# EAGLE design RC_Engine_Sound_ESP32 (EAGLE 9.6.1)
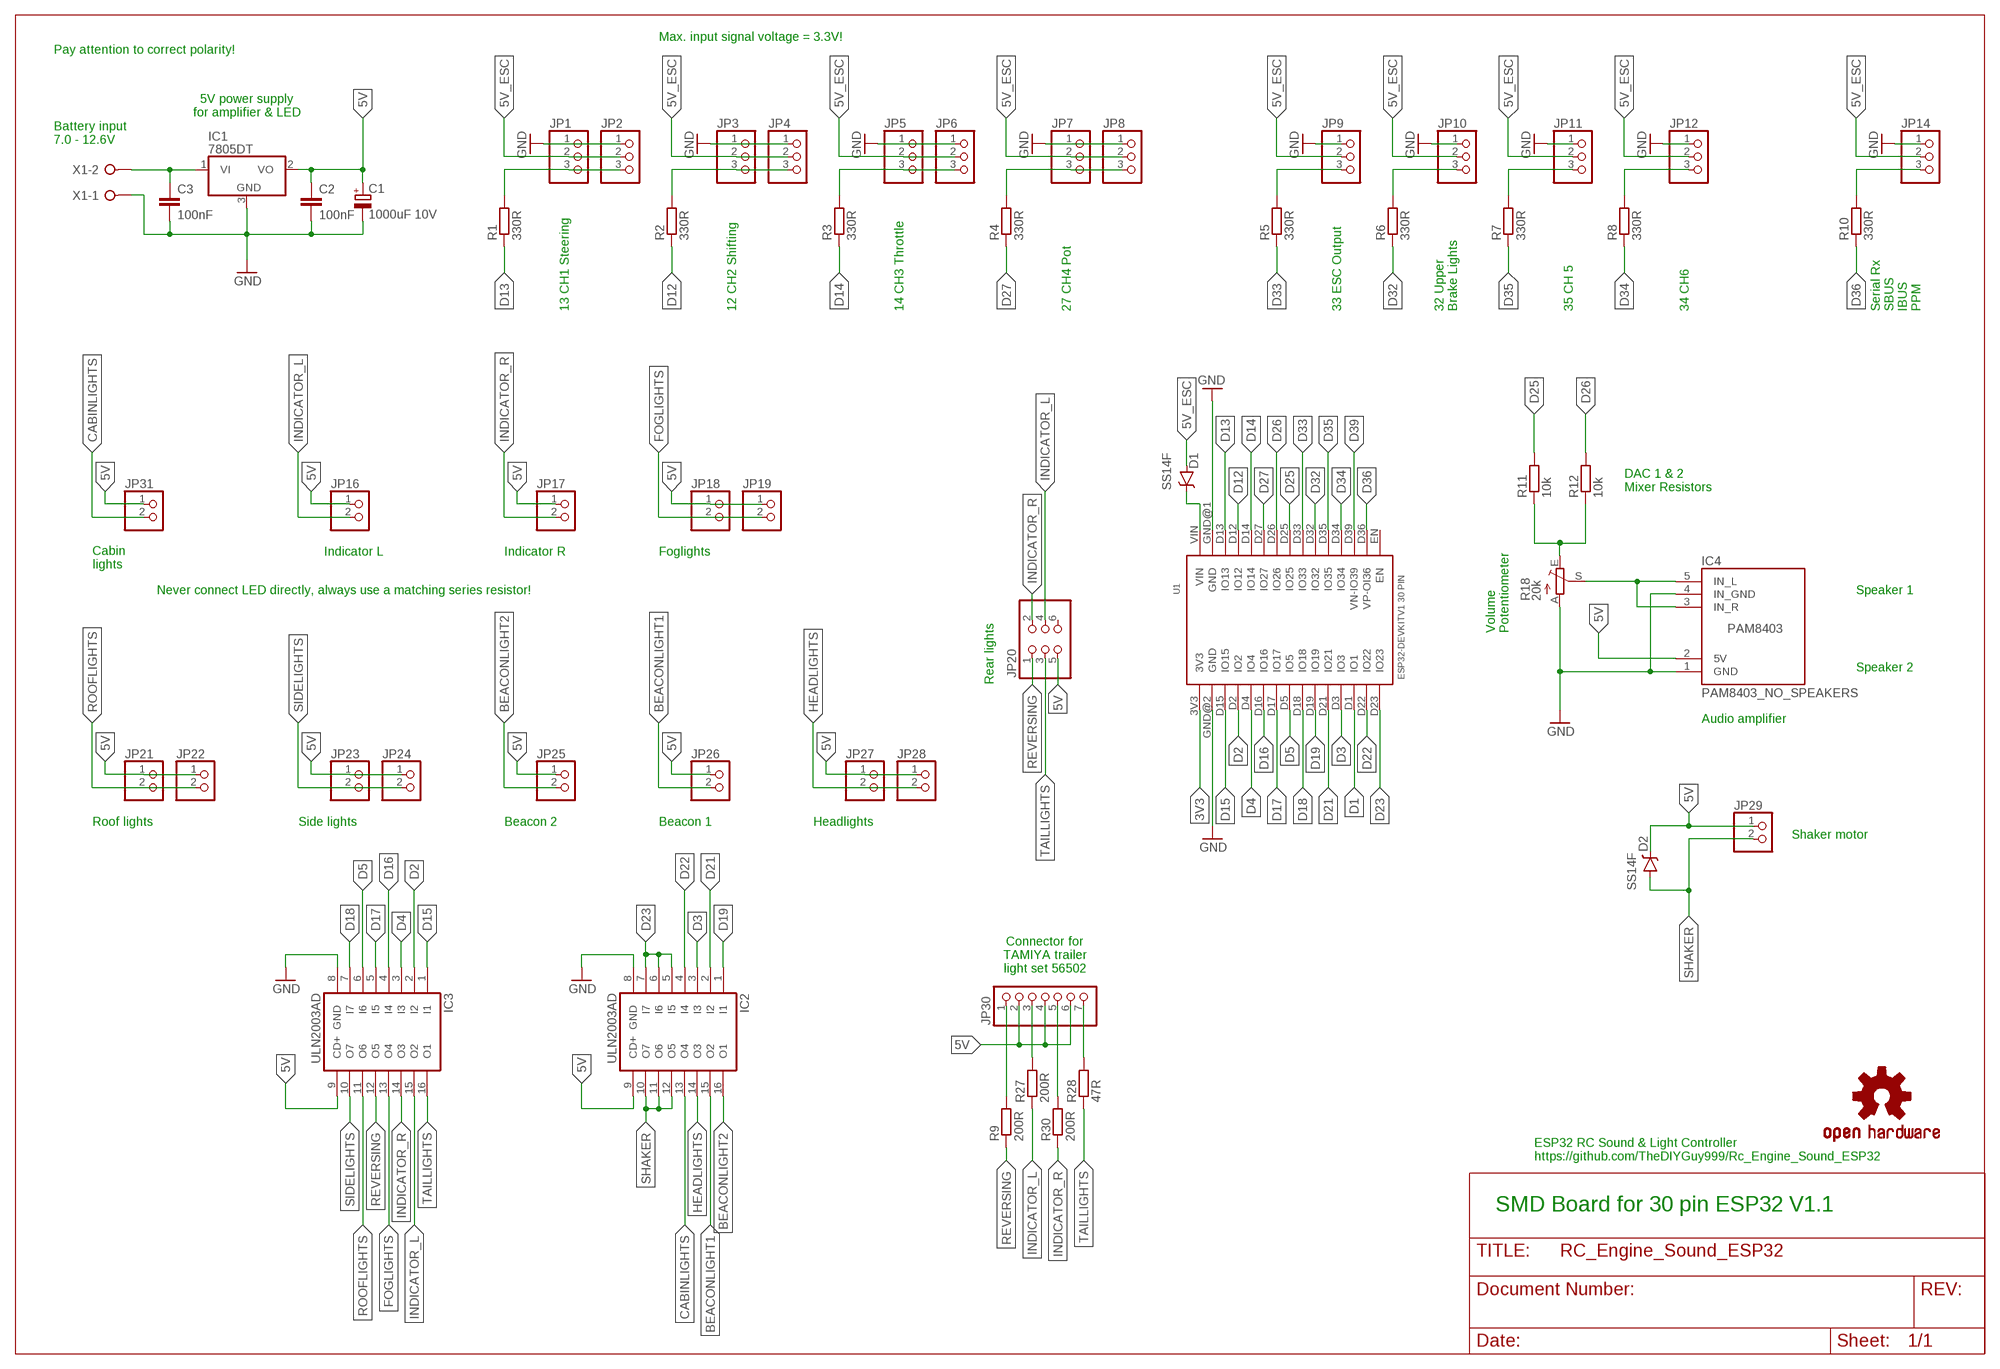
[diagram p0: schematic, sheet 1]

## Parts
C1  1000uF 10V  CPOL-EUUD-10X10  [UD-10X10_NICHICON]
C2  100nF  C-EUC0805  [C0805]
C3  100nF  C-EUC0805  [C0805]
D1  SS14F  MBRA140  [SMA-DIODE]
D2  SS14F  MBRA140  [SMA-DIODE]
IC1  7805DT  [TO252]
IC2  ULN2003AD  [SO16]
IC3  ULN2003AD  [SO16]
IC4  PAM8403_NO_SPEAKERS  [PAM8403_NO_SPEAKERS]
JP1  PINHD-1X3  [1X03]
JP2  PINHD-1X3  [1X03]
JP3  PINHD-1X3  [1X03]
JP4  PINHD-1X3  [1X03]
JP5  PINHD-1X3  [1X03]
JP6  PINHD-1X3  [1X03]
JP7  PINHD-1X3  [1X03]
JP8  PINHD-1X3  [1X03]
JP9  PINHD-1X3  [1X03]
JP10  PINHD-1X3  [1X03]
JP11  PINHD-1X3  [1X03]
JP12  PINHD-1X3  [1X03]
JP14  PINHD-1X3  [1X03]
JP16  PINHD-1X2  [1X02]
JP17  PINHD-1X2  [1X02]
JP18  PINHD-1X2  [1X02]
JP19  PINHD-1X2  [1X02]
JP20  PINHD-2X3  [2X03]
JP21  PINHD-1X2  [1X02]
JP22  PINHD-1X2  [1X02]
JP23  PINHD-1X2  [1X02]
JP24  PINHD-1X2  [1X02]
JP25  PINHD-1X2  [1X02]
JP26  PINHD-1X2  [1X02]
JP27  PINHD-1X2  [1X02]
JP28  PINHD-1X2  [1X02]
JP29  PINHD-1X2  [1X02]
JP30  PINHD-1X7  [1X07]
JP31  PINHD-1X2  [1X02]
LOGO1  OSHW-LOGOM  [OSHW-LOGO-M]
R1  330R  R-EU_R0805  [R0805]
R2  330R  R-EU_R0805  [R0805]
R3  330R  R-EU_R0805  [R0805]
R4  330R  R-EU_R0805  [R0805]
R5  330R  R-EU_R0805  [R0805]
R6  330R  R-EU_R0805  [R0805]
R7  330R  R-EU_R0805  [R0805]
R8  330R  R-EU_R0805  [R0805]
R9  200R  R-EU_R0805  [R0805]
R10  330R  R-EU_R0805  [R0805]
R11  10k  R-EU_R0805  [R0805]
R12  10k  R-EU_R0805  [R0805]
R18  20k  TRIM_EU-S64W  [S64W]
R27  200R  R-EU_R0805  [R0805]
R28  47R  R-EU_R0805  [R0805]
R30  200R  R-EU_R0805  [R0805]
U1  ESP32DEVKITV1  [ESP32-DEVKITV1]
X1  W237-02P  [W237-132]

## Nets
3V3: U1.3V3
5V: C1.+ C2.1 D2.C IC1.2(VO) IC2.9(CD+) IC3.9(CD+) IC4.2(5V) JP16.1 JP17.1 JP18.1 JP19.1 JP20.5 JP21.1 JP22.1 JP23.1 JP24.1 JP25.1 JP26.1 JP27.1 JP28.1 JP29.1 JP30.2 JP30.4 JP30.6 JP31.1
5V_ESC: D1.A JP1.2 JP2.2 JP3.2 JP4.2 JP5.2 JP6.2 JP7.2 JP8.2 JP9.2 JP10.2 JP11.2 JP12.2 JP14.2
BAT+: C3.1 IC1.1(VI) X1.2
BEACONLIGHT1: IC2.15(O2) JP26.2
BEACONLIGHT2: IC2.16(O1) JP25.2
CABINLIGHTS: IC2.13(O4) JP31.2
D1: U1.D1(IO1)
D2: IC3.2(I2) U1.D2(IO2)
D3: IC2.3(I3) U1.D3(IO3)
D4: IC3.3(I3) U1.D4(IO4)
D5: IC3.6(I6) U1.D5(IO5)
D12: R2.1 U1.D12(IO12)
D13: R1.1 U1.D13(IO13)
D14: R3.1 U1.D14(IO14)
D15: IC3.1(I1) U1.D15(IO15)
D16: IC3.4(I4) U1.D16(IO16)
D17: IC3.5(I5) U1.D17(IO17)
D18: IC3.7(I7) U1.D18(IO18)
D19: IC2.1(I1) U1.D19(IO19)
D21: IC2.2(I2) U1.D21(IO21)
D22: IC2.4(I4) U1.D22(IO22)
D23: IC2.5(I5) IC2.6(I6) IC2.7(I7) U1.D23(IO23)
D25: R11.2 U1.D25(IO25)
D26: R12.2 U1.D26(IO26)
D27: R4.1 U1.D27(IO27)
D32: R6.1 U1.D32(IO32)
D33: R5.1 U1.D33(IO33)
D34: R8.1 U1.D34(IO34)
D35: R7.1 U1.D35(IO35)
D36: R10.1 U1.D36(VP-OI36)
D39: U1.D39(VN-IO39)
FOGLIGHTS: IC3.13(O4) JP18.2 JP19.2
GND: C1.- C2.2 C3.2 IC1.3(GND) IC2.8(GND) IC3.8(GND) IC4.1(GND) IC4.4(IN_GND) JP1.1 JP2.1 JP3.1 JP4.1 JP5.1 JP6.1 JP7.1 JP8.1 JP9.1 JP10.1 JP11.1 JP12.1 JP14.1 R18.A U1.GND@1(GND) U1.GND@2(GND) X1.1
HEADLIGHTS: IC2.14(O3) JP27.2 JP28.2
INDICATOR_L: IC3.15(O2) JP16.2 JP20.4 R27.1
INDICATOR_R: IC3.14(O3) JP17.2 JP20.2 R30.1
N$1: IC4.3(IN_R) IC4.5(IN_L) R18.S
N$2: R11.1 R12.1 R18.E
N$3: JP1.3 JP2.3 R1.2
N$4: JP30.7 R28.2
N$5: JP3.3 JP4.3 R2.2
N$6: JP5.3 JP6.3 R3.2
N$7: JP7.3 JP8.3 R4.2
N$8: JP9.3 R5.2
N$9: D1.C U1.VIN
N$10: JP10.3 R6.2
N$11: JP11.3 R7.2
N$12: JP12.3 R8.2
N$13: JP30.5 R30.2
N$14: JP14.3 R10.2
N$15: JP30.3 R27.2
N$16: JP30.1 R9.2
REVERSING: IC3.12(O5) JP20.1 R9.1
ROOFLIGHTS: IC3.11(O6) JP21.2 JP22.2
SHAKER: D2.A IC2.10(O7) IC2.11(O6) IC2.12(O5) JP29.2
SIDELIGHTS: IC3.10(O7) JP23.2 JP24.2
TAILLIGHTS: IC3.16(O1) JP20.3 R28.1
Unconnected: JP20.6 U1.EN

## Notes on the sheet
- Max. input signal voltage = 3.3V!
- Pay attention to correct polarity!
- 5V power supply
  for amplifier & LED
- Battery input
  7.0 - 12.6V
- 13 CH1 Steering | 12 CH2 Shifting | 14 CH3 Throttle | 27 CH4 Pot | 33 ESC Output
- 32 Upper
  Brake Lights
- 35 CH 5 | 34 CH6
- Serial Rx
  SBUS
  IBUS
  PPM
- DAC 1 & 2
  Mixer Resistors
- Indicator L | Indicator R | Foglights
- Cabin
  lights
- Never connect LED directly, always use a matching series resistor! | Speaker 1
- Volume
  Potentiometer
- Speaker 2
- Rear lights
- Audio amplifier
- Roof lights | Side lights | Beacon 2 | Beacon 1 | Headlights
- Shaker motor
- Connector for
  TAMIYA trailer
  light set 56502
- ESP32 RC Sound & Light Controller
  https://github.com/TheDIYGuy999/Rc_Engine_Sound_ESP32
- SMD Board for 30 pin ESP32 V1.1

## Library data of the parts
C1 = rcl:CPOL-EU: POLARIZED CAPACITOR, European symbol; SPICEPREFIX: C
C2 C3 = rcl:C-EU: CAPACITOR, European symbol
D1 D2 = SparkFun-DiscreteSemi:MBRA140: 40V, 1A Schottky rectifier SMA/DO-214AC package DIO-08053; PROD_ID: DIO-08053
IC1 = linear:78*: Positive VOLTAGE REGULATOR Source: http://cache.national.com/ds/LM/LM78L05.pdf http://www.fairchildsemi.com/ds/LM/LM7805.pdf
IC2 IC3 = uln-udn:ULN2003A: DRIVER ARRAY
IC4 = 00_custom:PAM8403_NO_SPEAKERS
JP1-JP12 JP14 = 00_custom_pinhead:PINHD-1X3: PIN HEADER
JP16-JP19 JP21-JP29 JP31 = 00_custom_pinhead:PINHD-1X2: PIN HEADER
JP20 = 00_custom_pinhead:PINHD-2X3: PIN HEADER
JP30 = 00_custom_pinhead:PINHD-1X7: PIN HEADER
LOGO1 = SparkFun-Aesthetics:OSHW-LOGO: Open Source Hardware Logo This logo indicates the piece of hardware it is found on incorporates a OSHW license and/or adheres to the definition of open source hardware found here: http://freedomdefined.org/OSHW
R1-R12 R27 R28 R30 = rcl:R-EU_: RESISTOR, European symbol; SPICEPREFIX: R
R18 = pot:TRIM_EU-: POTENTIOMETER
U1 = ESP32-DEVKITV1_30pin:ESP32DEVKITV1
X1 = con-wago-508:W237-02P: WAGO SREW CLAMP; OC_FARNELL: unknown; OC_NEWARK: unknown

## Net classes
0 5V: clearance 0.254 mm

## Board
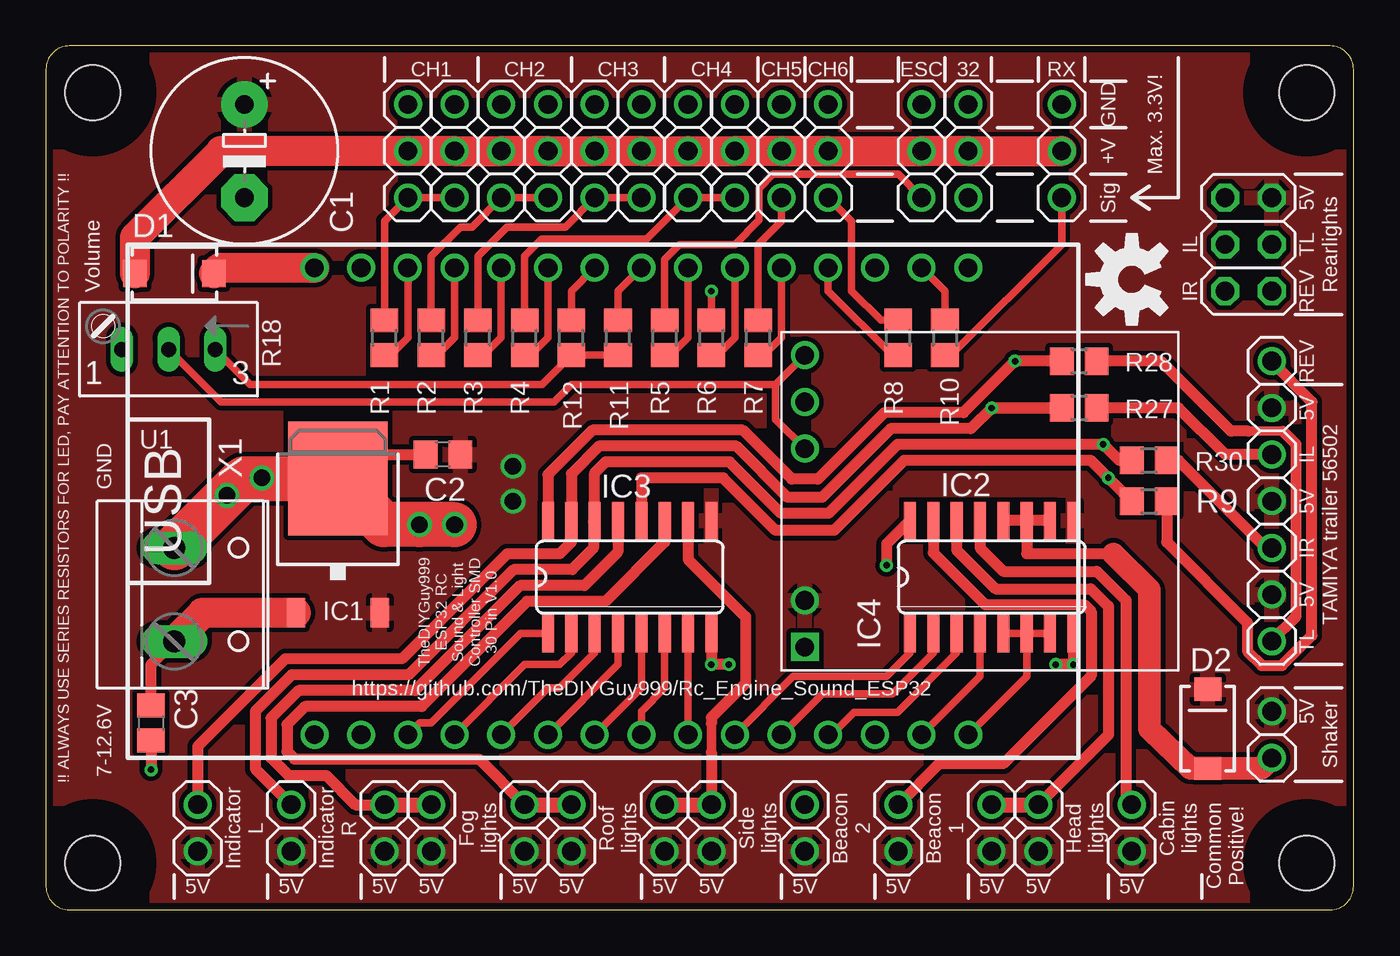
[diagram p1: board, top side]
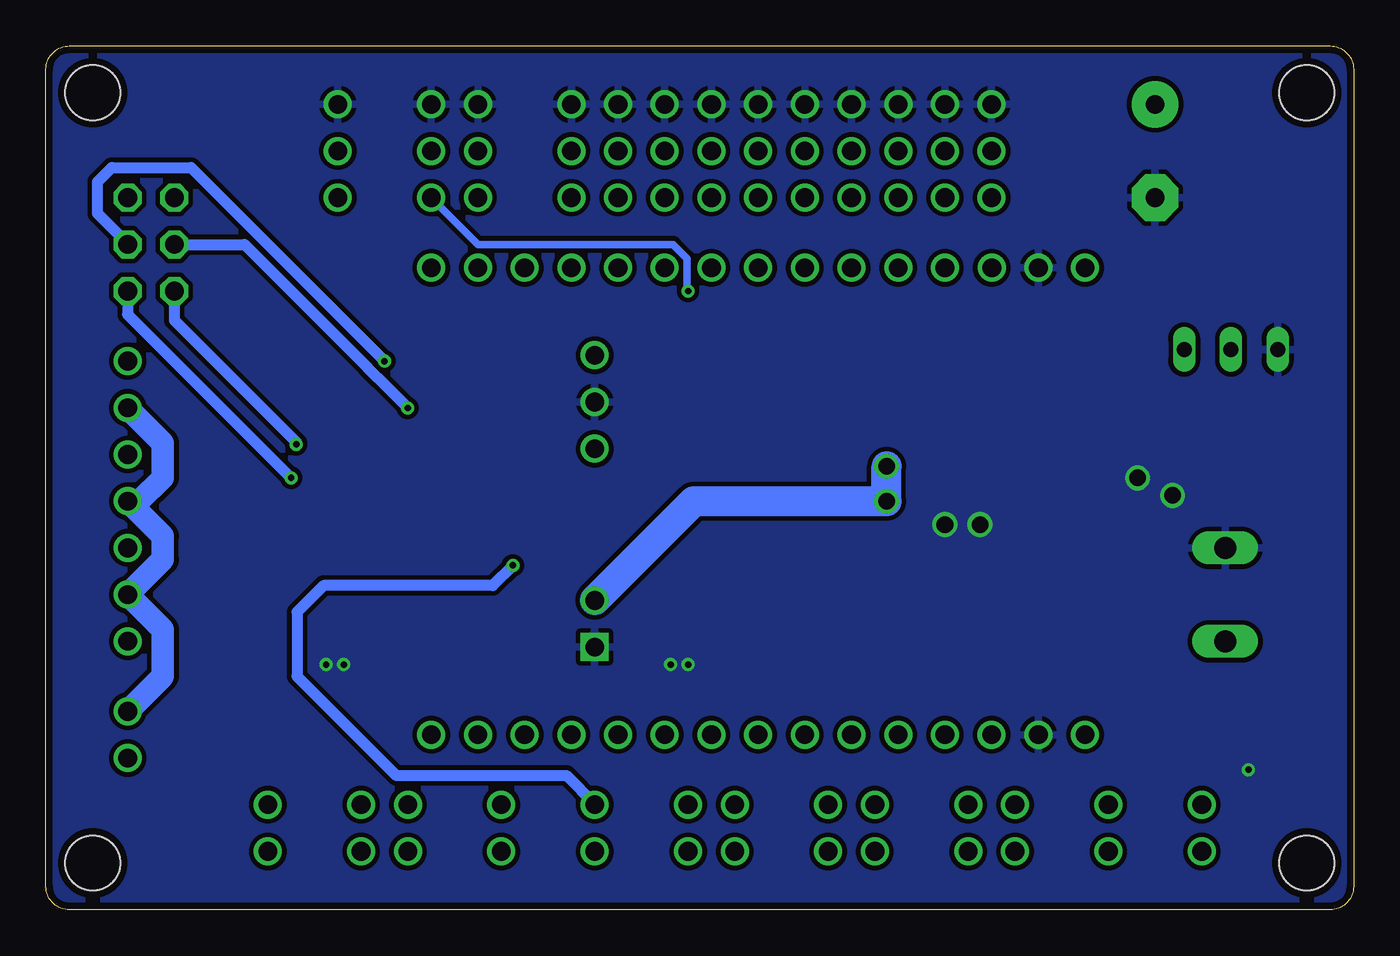
[diagram p2: board, bottom side, seen from below]

Size 71.12 x 46.99 mm. Coordinates in mm from the lower left corner, seen from the top.
Outline: 0,45.72 0,1.27 arc90 1.27,0 69.85,0 arc90 71.12,1.27 71.12,45.72 arc90 69.85,46.99 1.27,46.99 arc90 0,45.72
Copper layers (1*16): Top 0.0356mm / dielectric 1.5011mm / Bottom 0.0356mm
Design rules "OSHPark_LaenPCBOrder": minimum track width 6mil, minimum drill 13mil, track to track 6mil, track to pad 6mil, pad to pad 6mil, via to via 6mil, smd to smd 6mil, copper to edge 15mil, drill to drill 6mil, minimum pad ring 7mil, minimum via ring 7mil, stop-mask expansion 3mil, vias tented up to drill 0mil, thermal gap 10mil
Holes 3 mm at 2.54,44.45 2.54,2.54 68.58,2.54 68.58,44.45
tRestrict: area -0.7,41.2 to 5.8,47.7; area 65.3,41.2 to 71.8,47.7; area 65.3,-0.7 to 71.8,5.8; area -0.7,-0.7 to 5.8,5.8

### Footprints (pad centres in the part's own frame; a part is rotated, then mirrored left to right if it is on the bottom)
E5-10,5 = drill 1.016 pad 2.54: + -2.54,0 | drill 1.016 pad 2.54 octagon: - 2.54,0
C0805 = smd 1.3 x 1.5: 1 -0.95,0; 2 0.95,0
SMA-DIODE = smd 1.27 x 1.47: A -2.15,0; C 2.15,0
TO252 = smd 1 x 1.6: 1 -2.28,-4.8; 2 2.28,-4.8 | smd 5.4 x 6.2: 3 0,2.5
SO16 = smd 0.66 x 2.032: 1 -4.445,-3.073; 2 -3.175,-3.073; 3 -1.905,-3.073; 4 -0.635,-3.073; 5 0.635,-3.073; 6 1.905,-3.073; 7 3.175,-3.073; 8 4.445,-3.073; 9 4.445,3.073; 10 3.175,3.073; 11 1.905,3.073; 12 0.635,3.073; 13 -0.635,3.073; 14 -1.905,3.073; 15 -3.175,3.073; 16 -4.445,3.073
PAM8403_NO_SPEAKERS = drill 1.016 square: 1 -7.62,8.89 | drill 1.016: 2 -5.08,8.89; 3 3.175,8.89; 4 5.715,8.89; 5 8.255,8.89
1X03 = drill 1.016 pad 1.524: 1 -2.54,0; 2 0,0; 3 2.54,0
1X02 = drill 1.016 pad 1.524: 1 -1.27,0; 2 1.27,0
2X03 = drill 1.016 octagon: 1 -2.54,-1.27; 2 -2.54,1.27; 3 0,-1.27; 4 0,1.27; 5 2.54,-1.27; 6 2.54,1.27
1X07 = drill 1.016: 1 -7.62,0; 2 -5.08,0; 3 -2.54,0; 4 0,0; 5 2.54,0; 6 5.08,0; 7 7.62,0
R0805 = smd 1.3 x 1.5: 1 -0.95,0; 2 0.95,0
S64W = drill 0.813 long: A 2.54,1.27; E -2.54,1.27; S 0,1.27
ESP32-DEVKITV1 = drill 1.016: 3V3 -16.51,-12.7; D1 13.97,-12.7; D2 -8.89,-12.7; D3 11.43,-12.7; D4 -6.35,-12.7; D5 1.27,-12.7; D12 -8.89,12.7; D13 -11.44,12.7; D14 -6.35,12.7; D15 -11.43,-12.7; D16 -3.81,-12.7; D17 -1.27,-12.7; D18 3.81,-12.7; D19 6.35,-12.7; D21 8.89,-12.7; D22 16.51,-12.7; D23 19.05,-12.7; D25 1.27,12.7; D26 -1.27,12.7; D27 -3.81,12.7; D32 6.35,12.7; D33 3.81,12.7; D34 11.43,12.7; D35 8.89,12.7; D36 16.51,12.7; D39 13.97,12.7; EN 19.05,12.7; GND@1 -13.97,12.7; GND@2 -13.97,-12.7; VIN -16.51,12.7
W237-132 = drill 1.194 long: 1 -2.54,-0.635; 2 2.54,-0.635

### Placement (x,y rotation side)
C1  1000uF  [E5-10,5]  10.79,41.27 270 top
C2  21.59,24.77 180 top
C3  5.71,10.16 270 top
D1  6.99,34.61 0 top
D2  63.18,9.84 90 top
IC1  15.88,20.96 0 top
IC2  51.44,18.1 0 top
IC3  31.75,18.1 0 top
IC4  50.16,21.91 90 top
JP1  19.68,41.27 270 top
JP2  22.22,41.27 270 top
JP3  24.76,41.27 270 top
JP4  27.3,41.27 270 top
JP5  29.84,41.27 270 top
JP6  32.39,41.27 270 top
JP7  34.93,41.27 270 top
JP8  37.47,41.27 270 top
JP9  47.62,41.27 270 top
JP10  50.16,41.27 270 top
JP11  40.01,41.27 270 top
JP12  42.55,41.27 270 top
JP14  55.25,41.27 270 top
JP16  8.26,4.45 90 top
JP17  13.34,4.45 90 top
JP18  18.41,4.45 90 top
JP19  20.95,4.45 90 top
JP20  65.41,36.2 90 top
JP21  26.04,4.45 90 top
JP22  28.57,4.45 90 top
JP23  33.66,4.45 90 top
JP24  36.2,4.45 90 top
JP25  41.27,4.45 90 top
JP26  46.36,4.45 90 top
JP27  51.44,4.45 90 top
JP28  53.98,4.45 90 top
JP29  66.67,9.53 270 top
JP30  66.67,22.23 270 top
JP31  59.05,4.45 90 top
LOGO1  59.05,34.29 90 top
R1  18.41,31.12 90 top
R2  20.95,31.12 90 top
R3  23.49,31.12 90 top
R4  26.04,31.12 90 top
R5  33.66,31.12 90 top
R6  36.2,31.12 90 top
R7  38.73,31.12 90 top
R8  46.36,31.12 90 top
R9  60.01,22.23 0 top
R10  48.9,31.12 270 top
R11  31.11,31.12 90 top
R12  28.57,31.12 90 top
R18  6.67,31.75 180 top
R27  56.2,27.31 0 top
R28  56.2,29.85 0 top
R30  60.01,24.45 0 top
U1  31.11,22.23 0 top
X1  7.62,17.15 270 top

### Tracks (layer width: path | path; a pad name or v marks a point on that pad's centre or on a via)
5V  (via drill 0.9)
  Bottom 1.219: JP30.2 64.77,25.4 64.77,23.5 66.04,22.23 JP30.4 64.77,20.32 64.77,19.05 JP30.6 64.77,15.24 64.77,12.7 JP29.1
  Bottom 1.626: IC4.2 35.88,22.23 v25.4,22.23 v25.4,24.13
  pour Top: -3.13,-1.91 -3.13,19.52 -2.8,48.89 73.02,48.89 73.02,-1.91
5V_ESC
  Top 1.626: JP12.2 JP11.2 | JP11.2 JP9.2 JP10.2 JP14.2 | JP11.2 JP8.2 JP7.2 JP6.2 JP5.2 JP4.2 JP3.2 JP2.2 JP1.2 9.53,41.27 4.83,36.59 D1.A
BAT+
  Top 0.61: C3.1 5.71,13.33 X1.2
  Top 1.626: X1.2 6.99,14.62 8.52,16.16 IC1.1
BEACONLIGHT1
  Top 0.61: IC2.15 48.26,19.42 51.08,16.6 56.48,16.6 56.86,16.22 56.86,12.72 52.07,7.94 48.58,7.94 JP26.2
BEACONLIGHT2  (via drill 0.35)
  Top 0.61: IC2.16 45.72,19.9 v45.72,18.73
  Bottom 0.61: v45.72,18.73 46.82,17.64 56.02,17.64 57.47,16.19 57.47,12.7 52.07,7.3 42.81,7.3 41.27,5.77 JP25.2
CABINLIGHTS
  Top 0.61: IC2.13 50.8,19.69 52.07,18.42 57.15,18.42 58.74,16.83 58.74,6.03 JP31.2
D2
  Top 0.406: U1.D2 26.04,13.33 27.94,13.33 28.57,13.97 IC3.2
D3
  Top 0.406: IC2.3 49.53,13.97 46.3,10.74 43.95,10.74 42.73,9.53 U1.D3
D4
  Top 0.406: U1.D4 27.3,12.06 27.94,12.06 29.84,13.97 IC3.3
D5
  Top 0.406: U1.D5 32.39,10.79 33.66,12.06 33.66,15.88
  Top 0.61: IC3.6 33.66,15.88
D12
  Top 0.406: U1.D12 22.22,31.12 21.27,30.17 R2.1
D13
  Top 0.406: U1.D13 19.68,31.12 18.73,30.17 R1.1
D14
  Top 0.406: U1.D14 24.76,31.12 23.81,30.17 R3.1
D15
  Top 0.406: U1.D15 20.32,10.16 20.95,10.16 25.82,15.02 IC3.1
D16
  Top 0.406: U1.D16 31.11,13.33 IC3.4
D17
  Top 0.406: U1.D17 32.39,12.06 IC3.5
D18
  Top 0.406: U1.D18 IC3.7
D19
  Top 0.406: U1.D19 40.64,12.7 45.72,12.7 46.99,13.97 IC2.1
D21
  Top 0.406: IC2.2 48.26,13.97 46.04,11.75 42.23,11.75 U1.D21
D22
  Top 0.406: IC2.4 50.8,12.7 U1.D22
D23
  Top 0.406: IC2.7 IC2.6 | IC2.6 IC2.5 | IC2.6 53.34,12.7 U1.D23
D25
  Top 0.406: R11.2 31.11,33.66 U1.D25
D26
  Top 0.406: R12.2 28.57,33.66 U1.D26
D27
  Top 0.406: U1.D27 27.3,31.12 26.35,30.17 R4.1
D32
  Top 0.406: U1.D32 37.47,31.12 36.52,30.17 R6.1
D33
  Top 0.406: U1.D33 34.93,31.12 33.98,30.17 R5.1
D34
  Top 0.406: U1.D34 42.55,33.66 46.04,30.17 R8.1
D35
  Top 0.406: U1.D35 40.01,31.12 39.05,30.17 R7.1
D36
  Top 0.406: U1.D36 48.9,33.66 R10.1
FOGLIGHTS
  Top 0.61: JP18.2 16.83,5.71 15.24,7.3 13.2,7.3 12.24,8.26 12.24,10.44 13.73,11.92 20.08,11.92 25.8,17.64 29.29,17.64 31.11,19.46 IC3.13
  Top 0.813: JP18.2 JP19.2
GND  (via drill 0.35, 0.9)
  Top 0.61: IC3.8 v36.2,13.33 v37.15,13.33 | IC2.8 v55.88,13.33 v54.93,13.33 | IC1.3 17.18,24.77 C2.2 | C3.2 v5.71,7.62
  Top 2.438: X1.1 10.76,23.46 IC1.3 18.38,20.96 v20.32,20.96 v22.22,20.96
  other vias: 11.75,23.5 9.84,22.54
  pour Bottom: -0.64,47.62 71.75,47.62 71.75,-0.64 -0.64,-0.64
HEADLIGHTS
  Top 0.61: IC2.14 49.53,19.58 51.65,17.46 56.83,17.46 57.79,16.51 57.79,9.53 JP28.2
  Top 0.813: JP27.2 JP28.2
INDICATOR_L  (via drill 0.35)
  Top 0.61: JP16.2 8.26,8.89 13.02,13.65 19.37,13.65 25.08,19.37 27.94,19.37 28.57,20 IC3.15 28.57,23.71 30.08,25.22 37.55,25.22 40.34,22.43 42.21,22.43 45.96,26.18 50.31,26.18 v51.44,27.31 R27.1 51.46,27.31 v51.45,27.29
  Bottom 0.61: JP20.4 60.33,36.2 53.62,29.49 53.62,29.47 53.09,28.93 53.06,28.93 v51.44,27.31 v51.45,27.29
INDICATOR_R  (via drill 0.35)
  Top 0.61: R30.1 58.37,24.45 v57.51,25.31 46.32,25.31 42.57,21.57 39.98,21.57 37.19,24.36 30.44,24.36 29.84,23.76 IC3.14 29.78,21.11 29.78,19.67 28.61,18.5 25.44,18.5 19.72,12.79 13.38,12.79 11.38,10.79 11.38,7.67 JP17.2
  Bottom 0.61: JP20.2 64.13,32.07 57.47,25.4 57.47,25.35 v57.51,25.31
N$1
  Top 0.406: IC4.3 39.69,26.67 39.69,28.58 | R18.S 9.53,27.62 27.62,27.62 28.57,28.58 39.69,28.58 | IC4.5 39.69,28.58
N$2
  Top 0.406: R11.1 R12.1 26.98,28.58 11.11,28.58 R18.E
N$3
  Top 0.406: R1.2 18.41,37.46 JP1.3 JP2.3
N$4
  Top 0.508: 67.27,26.04 65.41,26.04
  Top 0.61: JP30.7 66.67,14.64 68,15.96 68,25.31 67.27,26.04 | 65.41,26.04 64.45,26.04 60.64,29.85 R28.2
N$5
  Top 0.406: R2.2 20.95,35.56 22.54,37.15 23.18,37.15 JP3.3 JP4.3
N$6
  Top 0.406: JP6.3 JP5.3 28.26,37.15 25.08,37.15 23.49,35.56 R3.2
N$7
  Top 0.406: JP8.3 JP7.3 32.68,36.49 26.96,36.49 26.04,35.56 R4.2
N$8
  Top 0.406: JP9.3 46.36,40 39.55,40 38.79,39.24 38.79,37.52 37.47,36.2 34.47,36.2 33.66,35.38 R5.2
N$9
  Top 1.626: D1.C 9.45,34.92 U1.VIN
N$10  (via drill 0.35)
  Top 0.406: R6.2 v36.2,33.66
  Bottom 0.406: v36.2,33.66 36.25,33.71 36.25,35.43 37.01,36.2 47.62,36.2 JP10.3
N$11
  Top 0.406: R7.2 38.73,36.2 40.01,37.46 JP11.3
N$12
  Top 0.406: JP12.3 43.82,37.46 43.82,33.66 45.41,32.06 R8.2
N$13
  Top 0.61: JP30.5 66.36,19.69 61.59,24.45 R30.2
N$14
  Top 0.406: R10.2 49.22,30.17 55.25,36.2 JP14.3
N$15
  Top 0.61: JP30.3 64.13,24.77 61.59,27.31 R27.2
N$16
  Top 0.61: JP30.1 66.67,29.81 68.86,27.62 68.86,14.92 67.22,13.28 66.13,13.28 65.35,14.06 65.35,15.61 60.96,20 R9.2
REVERSING  (via drill 0.35)
  Top 0.61: R9.1 58.74,22.54 v57.79,23.5 56.83,24.45 46.67,24.45 42.86,20.64 39.69,20.64 36.83,23.5 32.39,23.5 IC3.12
  Bottom 0.61: JP20.1 66.67,32.38 v57.79,23.5
ROOFLIGHTS
  Top 0.61: IC3.11 33.66,20 30.43,16.78 26.16,16.78 20.44,11.06 14.09,11.06 13.11,10.08 13.11,8.61 13.52,8.2 23.55,8.2 JP21.2
  Top 0.813: JP21.2 JP22.2
SHAKER
  Top 0.61: IC2.10 IC2.11 | IC2.11 IC2.12 | IC2.11 53.34,19.37 58.05,19.37 | D2.A 63.11,7.69
  Top 1.219: 58.05,19.37 60.01,17.41 60.01,9.83 62.23,7.69 63.11,7.69 | JP29.2 66.11,7.69 D2.A
SIDELIGHTS
  Top 0.508: 36.2,10.12 36.2,8.57
  Top 0.61: 36.2,10.12 36.2,10.46 38.06,12.32 38.06,15.93 34.93,19.07 IC3.10 | 36.2,8.57 JP24.2
  Top 0.813: JP23.2 JP24.2
TAILLIGHTS  (via drill 0.35)
  Top 0.61: R28.1 v52.71,29.85 49.9,27.04 45.6,27.04 41.98,23.42 40.57,23.42 37.9,26.09 29.72,26.09 27.3,23.67 IC3.16
  Bottom 0.61: JP20.3 66.67,36.23 68.31,37.87 68.31,39.6 67.54,40.37 63.23,40.37 v52.71,29.85

### Text on the board
tNames: CH1 | CH2 | CH3 | CH4 | CH5 | CH6 | ESC | 32 | RX | GND | +V | Max. 3.3V! | Sig | 5V | IL | TL | Rearlights | Volume | IR | REV | REV | 5V | IL | !! ALWAYS USE SERIES RESISTORS FOR LED, PAY ATTENTION TO POLARITY !! | GND | 5V | TAMIYA trailer 56502 | IR | 5V | TheDIYGuy999 / ESP32 RC / Sound & Light / Controller SMD / 30 Pin V1.0 | TL | https://github.com/TheDIYGuy999/Rc_Engine_Sound_ESP32 | 5V | 7-12.6V | Shaker | Indicator / L | Indicator / R | Fog / lights | Roof / lights | Side / lights | Beacon / 2 | Beacon / 1 | Head / lights | Cabin / lights | Common / Positive! | 5V | 5V | 5V | 5V | 5V | 5V | 5V | 5V | 5V | 5V | 5V | 5V | 5V